# EAGLE schematic kitten-heater-board (EAGLE 5.10)
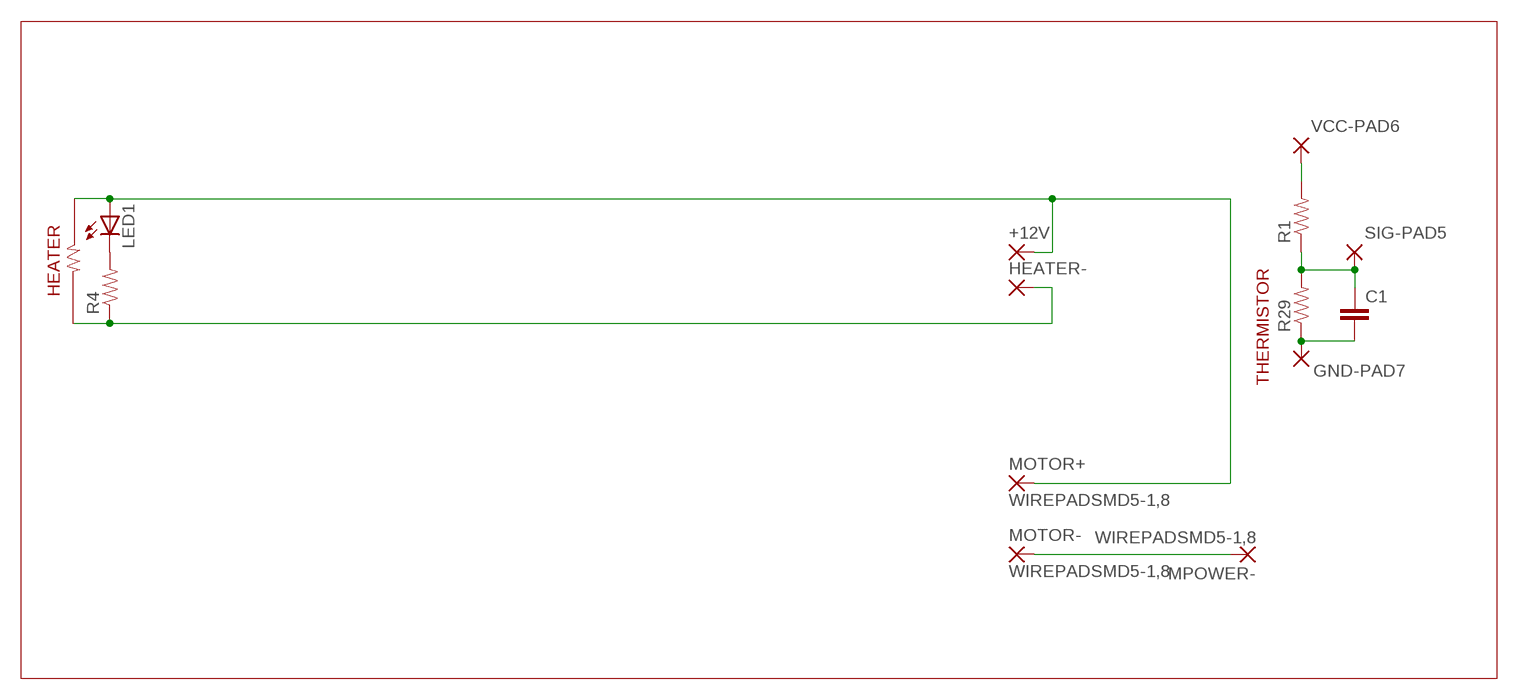
[diagram p0: schematic, sheet 1]

## Parts
+12V  WIREPADSMD5-1,8  [5-1,8]
C1  C-EUC1206  [C1206]
GND-PAD7  WIREPADSMD5-1,8  [5-1,8]
HEATER-  WIREPADSMD5-1,8  [5-1,8]
LED1  LED1206  [LED-1206]
MOTOR+  WIREPADSMD5-1,8  [5-1,8]
MOTOR-  WIREPADSMD5-1,8  [5-1,8]
MPOWER-  WIREPADSMD5-1,8  [5-1,8]
R1  RESISTOR1206  [1206]
R4  RESISTOR1206  [1206]
R29  RESISTOR1206  [1206]
SIG-PAD5  WIREPADSMD5-1,8  [5-1,8]
VCC-PAD6  WIREPADSMD5-1,8  [5-1,8]

## Nets
N$1: HEATER-.1(P) R4.1
N$2: LED1.C R4.2
N$3: C1.2 GND-PAD7.1(P) R29.1
N$4: C1.1 R1.1 R29.2 SIG-PAD5.1(P)
N$6: MOTOR-.1(P) MPOWER-.1(P)
N$8: R1.2 VCC-PAD6.1(P)
N$37: +12V.1(P) LED1.A MOTOR+.1(P)

## Notes on the sheet
- HEATER
- THERMISTOR

## Library data of the parts
+12V GND-PAD7 HEATER- MOTOR+ MOTOR- MPOWER- SIG-PAD5 VCC-PAD6 = wirepad:WIREPAD: Wire PAD connect wire on PCB
C1 = resistor:C-EU: CAPACITOR, European symbol
LED1 = SparkFun:LED: LEDs Standard schematic elements and footprints for 5mm, 3mm, 1206, and 0603 sized LEDs. 5mm - Spark Fun Electronics SKU : COM-00529 (and others)
R1 R4 R29 = SparkFun:RESISTOR: Resistor Basic schematic elements and footprints for 0603, 1206, and PTH 1/10th watt (small) resistors.